# Altium schematic sheet Sheet3.SchDoc
size A4; SheetNumber: 1; SheetTotal: 3
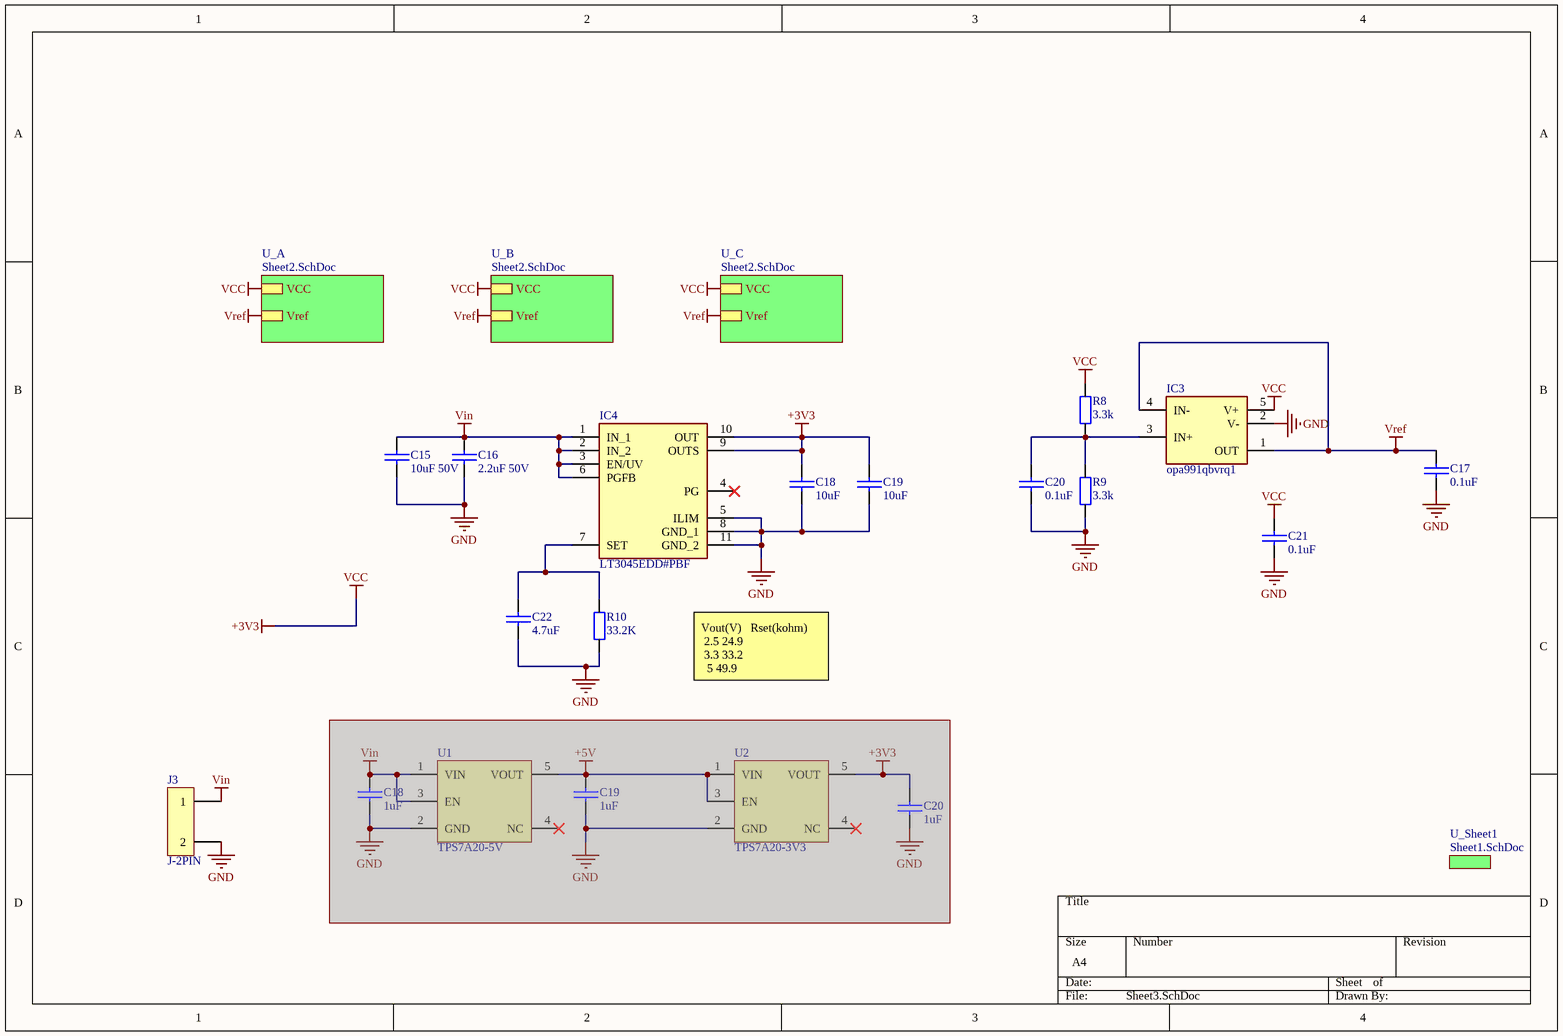
[diagram p0: Sheet3.SchDoc]

## Parts
(Parts that share a designator on the sheet are numbered #1, #2 ... from top to bottom, then left to right.)
C15  10uF 50V  [C-1206]
C16  2.2uF 50V  [C-1206]
C17  0.1uF  [C-0603]
C18#1  10uF  [C-1206]
C18#2  1uF  [C-0603]  (masked out: inside a compile mask, not in the netlist)
C19#1  10uF  [C-1206]
C19#2  1uF  [C-0603]  (masked out: inside a compile mask, not in the netlist)
C20#1  0.1uF  [C-0603]
C20#2  1uF  [C-0603]  (masked out: inside a compile mask, not in the netlist)
C21  0.1uF  [C-0603]
C22  4.7uF  [C-0603]
IC3  opa991qbvrq1  [SOT95P280X145-5N]
IC4  LT3045EDD#PBF  [SON50P300X300X80-11N-D]
J3  J-2PIN  [CON  7.62mm 2x1P]
R8  3.3k  [R-0603]
R9  3.3k  [R-0603]
R10  33.2K  [R-0603]
U1  TPS7A20-5V  [SOT-235]  (masked out: inside a compile mask, not in the netlist)
U2  TPS7A20-3V3  [SOT-235]  (masked out: inside a compile mask, not in the netlist)

## Sub-sheets
U_A = Sheet2.SchDoc: VCC, Vref
U_B = Sheet2.SchDoc: VCC, Vref
U_C = Sheet2.SchDoc: VCC, Vref
U_Sheet1 = Sheet1.SchDoc: no entries

## Nets
+3V3: C18#1.1 C19#1.1 C21.2 IC3.5(V+) IC4.9(OUTS) IC4.10(OUT) R8.2 ; sheet U_A/VCC, sheet U_B/VCC, sheet U_C/VCC  [also labelled VCC]
GND: C15.2 C16.2 C17.1 C18#1.2 C19#1.2 C20#1.1 C21.1 C22.2 IC3.2(V-) IC4.5(ILIM) IC4.8(GND_1) IC4.11(GND_2) J3.2 R9.1 R10.2
Vin: C15.1 C16.1 IC4.1(IN_1) IC4.2(IN_2) IC4.3(EN/UV) IC4.6(PGFB) J3.1
Vref: C17.2 IC3.1(OUT) IC3.4(IN-) ; sheet U_A/Vref, sheet U_B/Vref, sheet U_C/Vref
NetC20#1_2: C20#1.2 IC3.3(IN+) R8.1 R9.2
NetC22_1: C22.1 IC4.7(SET) R10.1

Not connected (* = marked no-connect by the designer): IC4 4(PG)*

## Notes on the sheet
- Vout(V)   Rset(kohm)
  2.5	24.9
  3.3	33.2
  5	49.9

## Library data of the parts
C15-C17 C18#1 C18#2 C19#1 C19#2 C20#1 C20#2 C21 C22 = C: Non Polarised
IC3 = TLV9001IDBVR: Integrated Circuit; Manufacturer_Name: Texas Instruments; Datasheet Link: http://www.ti.com/lit/gpn/tlv9001; Height: 1.45mm; Manufacturer_Part_Number: TLV9001IDBVR; Mouser Part Number: 595-TLV9001IDBVR; Mouser Price/Stock: https://www.mouser.co.uk/ProductDetail/Texas-Instruments/TLV9001IDBVR?qs=gTYE2QTfZfR6dUkET6Yj7w%3D%3D; Arrow Part Number: TLV9001IDBVR; Arrow Price/Stock: https://www.arrow.com/en/products/tlv9001idbvr/texas-instruments?region=europe
IC4 = LT3045EDD#PBF: Integrated Circuit; Manufacturer_Name: Analog Devices; Datasheet Link: https://www.analog.com/LT3045/datasheet; Height: 0.8mm; Manufacturer_Part_Number: LT3045EDD#PBF; Mouser Part Number: 584-LT3045EDD#PBF; Mouser Price/Stock: https://www.mouser.co.uk/ProductDetail/Analog-Devices/LT3045EDDPBF?qs=oahfZPh6IAItEW%2FaDCA8LQ%3D%3D; Arrow Part Number: LT3045EDD#PBF; Arrow Price/Stock: https://www.arrow.com/en/products/lt3045eddpbf/analog-devices?utm_currency=USD&region=europe
R8-R10 = R: Resistor
U1 U2 = TPS7A20-3V3: LDO  最大输出300mA